# Altium schematic sheet ESP_12主板.SchDoc
size A4
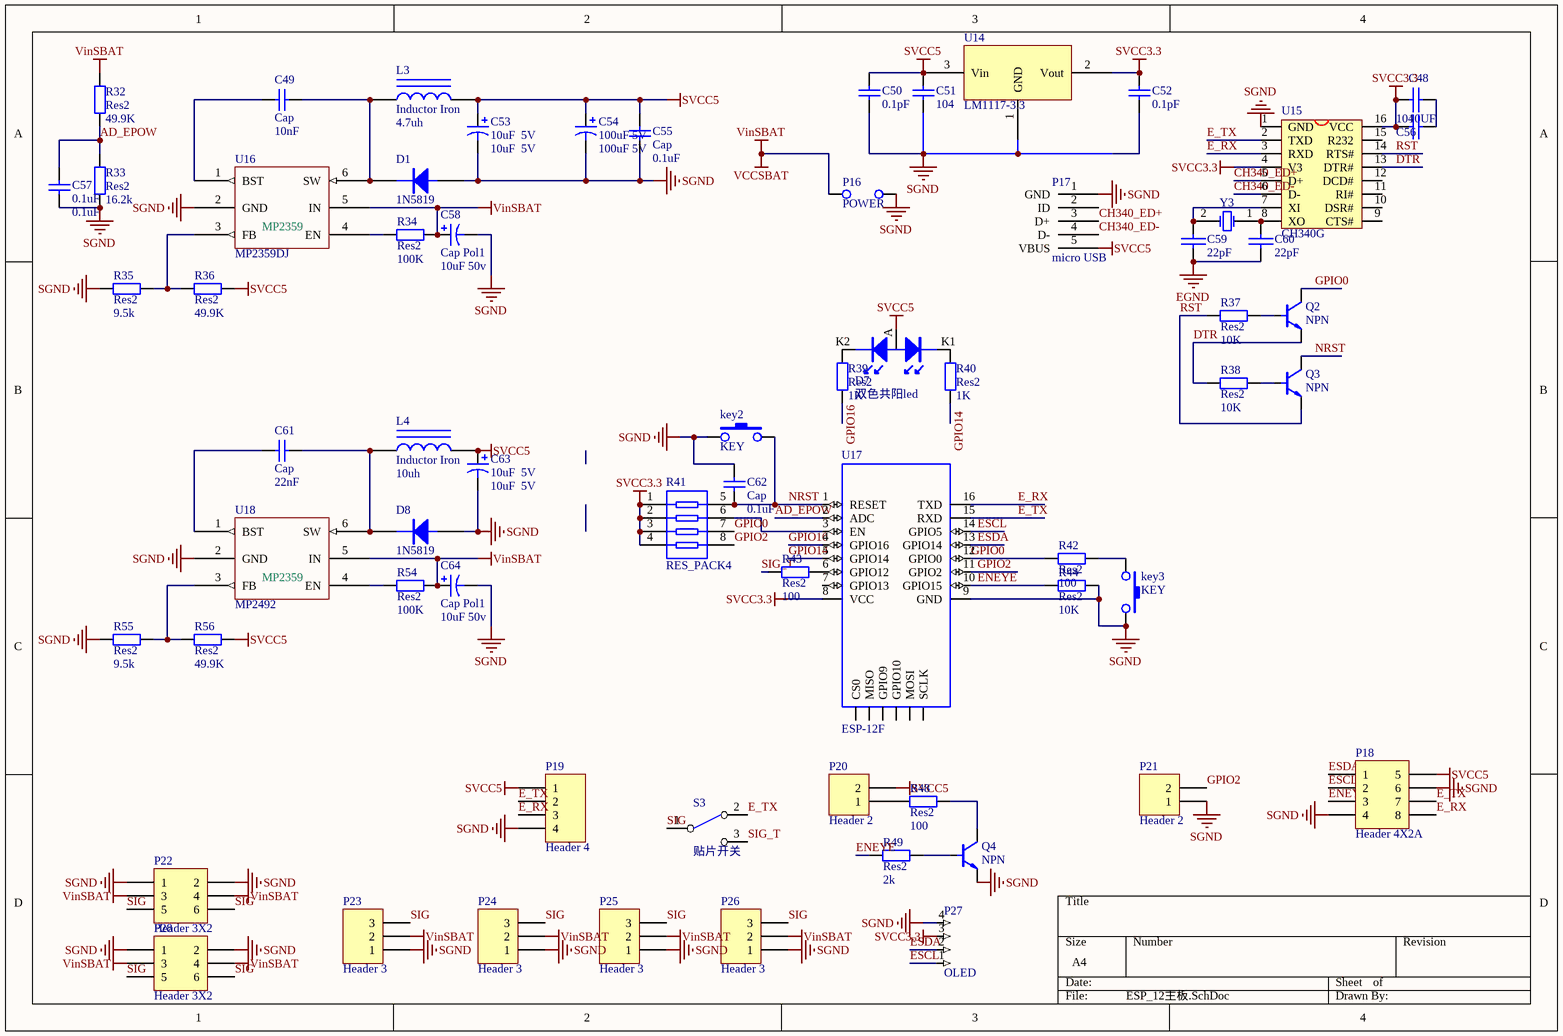
[diagram p0: ESP_12主板.SchDoc]

## Parts
C48  value 10UF  [LC-0603_C]  (hidden comment: CAP)
C49  Cap  value 10nF  [LC-0603_C]
C50  value 0.1pF  [LC-0603_C]  (hidden comment: Cap)
C51  value 104  [LC-1210_C]  (hidden comment: Cap)
C52  value 0.1pF  [LC-0603_C]  (hidden comment: Cap)
C53  10uF  5V  [LC-1210_C]
C54  100uF 5V  [电容HONOR_63X77]
C55  Cap  value 0.1uF  [LC-0603_C]
C56  value 104  [LC-1206_C]  (hidden comment: CAP)
C57  0.1uF  [LC-0603_C]
C58  Cap Pol1  value 10uF 50v  [电容HONOR_63X54]
C59  value 22pF  [LC-0603_C]  (hidden comment: CAP)
C60  value 22pF  [LC-0603_C]  (hidden comment: CAP)
C61  Cap  value 22nF  [LC-0603_C]
C62  Cap  value 0.1uF  [LC-0603_C]
C63  10uF  5V  [LC-1210_C]
C64  Cap Pol1  value 10uF 50v  [电容HONOR_63X54]
D1  1N5819  [SMA]
D7  双色共阳led  [共阳双色LED]
D8  1N5819  [SMA]
key2  KEY  [SMD轻触按键]
key3  KEY  [SMD轻触按键]
L3  Inductor Iron  value 4.7uh  [电感GDCD4532]
L4  Inductor Iron  value 10uh  [电感GDCD4532]
P16  POWER  [电源]
P17  micro USB  [micro 5P沉板式0.8四脚全插无导位有孔]
P18  Header 4X2A  [HDR2X4_CEN]
P19  Header 4  [HDR1X4]
P20  Header 2  [HDR1X2]
P21  Header 2  [HDR1X2]
P22  Header 3X2  [HDR2X3]
P23  Header 3  [AMP 3针连接件]
P24  Header 3  [AMP 3针连接件]
P25  Header 3  [AMP 3针连接件]
P26  Header 3  [AMP 3针连接件]
P27  OLED  [1.0MM 翻盖 下接 FPC连接器 4P]
P28  Header 3X2  [HDR2X3]
Q2  NPN  [LC-SOT-23]
Q3  NPN  [LC-SOT-23]
Q4  NPN  [LC-SOT-23]
R32  Res2  value 49.9K  [LC-0603_R]
R33  Res2  value 16.2k  [LC-0603_R]
R34  Res2  value 100K  [LC-0603_R]
R35  Res2  value 9.5k  [LC-0603_R]
R36  Res2  value 49.9K  [LC-0603_R]
R37  Res2  value 10K  [LC-0603_R]
R38  Res2  value 10K  [LC-0603_R]
R39  Res2  value 1K  [LC-0603_R]
R40  Res2  value 1K  [LC-0603_R]
R41  RES_PACK4  [RES4]
R42  Res2  value 100  [LC-0603_R]
R43  Res2  value 100  [LC-0603_R]
R44  Res2  value 10K  [LC-0603_R]
R48  Res2  value 100  [LC-0603_R]
R49  Res2  value 2k  [LC-0603_R]
R54  Res2  value 100K  [LC-0603_R]
R55  Res2  value 9.5k  [LC-0603_R]
R56  Res2  value 49.9K  [LC-0603_R]
S3  贴片开关  [KEY]
U14  LM1117-3.3  [SOT223]
U15  CH340G  [SOP16M]
U16  MP2359DJ  [LC-SOT-23-6]
U17  ESP-12F  [ESP_12]
U18  MP2492  [LC-SOT-23-6]
Y3  12MHz  [49SMD]  (value not drawn)

## Nets
EGND: C59.1 C60.1
SGND: C50.2 C51.1 C52.2 C53.2 C54.2 C55.1 C57.2 C58.2 C62.2 C63.2 C64.2 D1.A D8.A key2.1 key3.2 P16.2 P17.1(GND) P18.4 P18.6 P19.4 P21.1 P22.1 P22.2 P23.1 P24.1 P25.1 P26.1 P27.4 P28.1 P28.2 Q4.E(e) R33.2 R35.2 R44.2 R55.2 U14.1(GND) U15.1(GND) U16.2(GND) U17.9(GND) U18.2(GND)
SVCC3.3: C48.2 C52.1 C56.1 P27.3 R41.1 R41.2 R41.3 R41.4 U14.2(Vout) U15.4(V3) U15.16(VCC) U17.8(VCC)
SVCC5: C50.1 C51.2 C53.1 C54.1 C55.2 C63.1 D7.A L3.2 L4.2 P17.5(VBUS) P18.5 P19.1 P20.2 R36.1 R56.1 U14.3(Vin)
VCCSBAT: C58.1 C64.1 P16.1 P22.3 P22.4 P23.2 P24.2 P25.2 P26.2 P28.3 P28.4 R32.1 R34.2 R54.2 U16.5(IN) U18.5(IN)  [also labelled VinSBAT]
AD_EPOW: C57.1 R32.2 R33.1 U17.2(ADC)
CH340_ED+: P17.3(D+) U15.5(D+)
CH340_ED-: P17.4(D-) U15.6(D-)
DTR: Q2.E(e) R38.1 U15.13(DTR#)
E_RX: P18.8 P19.3 U15.3(RXD) U17.16(TXD)
E_TX: P18.7 P19.2 S3.2(NC1) U15.2(TXD) U17.15(RXD)
ENEYE: P18.3 R44.1 R49.2 U17.10(GPIO15)
ESCL: P18.2 P27.1 U17.14(GPIO5)
ESDA: P18.1 P27.2 U17.13(GPIO14)
GPIO0: Q2.C(c) R41.7 R42.1 U17.12(GPIO0)
GPIO2: P21.2 R41.8 U17.11(GPIO2)
GPIO14: R40.1 U17.5(GPIO14)
GPIO16: R39.1 U17.4(GPIO16)
NRST: C62.1 key2.2 Q3.C(c) R41.5 U17.1(RESET)
RST: Q3.E(e) R37.1 U15.14(RTS#)
SIG: P22.5 P22.6 P23.3 P24.3 P25.3 P26.3 P28.5 P28.6 S3.1(COMMON1)
SIG_T: R43.1 S3.3(NO1)
NetC48_1: C48.1 C56.2
NetC49_1: C49.1 U16.1(BST)
NetC49_2: C49.2 D1.K L3.1 U16.6(SW)
NetC59_2: C59.2 U15.7(XI) Y3.2(OSC2)
NetC60_2: C60.2 U15.8(XO) Y3.1(OSC1)
NetC61_1: C61.1 U18.1(BST)
NetC61_2: C61.2 D8.K L4.1 U18.6(SW)
NetD7_K1: D7.K1 R40.2
NetD7_K2: D7.K2 R39.2
Netkey3_1: key3.1 R42.2
NetP20_1: P20.1 R48.1
NetQ2_B: Q2.B(b) R37.2
NetQ3_B: Q3.B(b) R38.2
NetQ4_B: Q4.B(b) R49.1
NetQ4_C: Q4.C(c) R48.2
NetR34_1: R34.1 U16.4(EN)
NetR35_1: R35.1 R36.2 U16.3(FB)
NetR41_6: R41.6 U17.3(EN)
NetR43_2: R43.2 U17.6(GPIO12)
NetR54_1: R54.1 U18.4(EN)
NetR55_1: R55.1 R56.2 U18.3(FB)

Not connected (* = marked no-connect by the designer): P17 2(ID); U15 9(CTS#) 10(DSR#) 11(RI#) 12(DCD#) 15(R232); U17 7(GPIO13) 17(CS0) 18(MISO) 19(GPIO9) 20(GPIO10) 21(MOSI) 22(SCLK)

## Notes on the sheet
- (in symbol MP2359DJ) MP2359

## Library data of the parts
C49-C52 C55 C57 C61 C62 = Cap: Capacitor; Published: 8-Jun-2000; LatestRevisionDate: 17-Jul-2002; LatestRevisionNote: Re-released for DXP Platform.; PackageReference: RAD-0.3; Publisher: Altium Limited
  C57: Value: 0.1uF
C53 C54 C58 C63 C64 = Cap Pol1: Polarized Capacitor (Radial); Published: 8-Jun-2000; LatestRevisionDate: 17-Jul-2002; LatestRevisionNote: Re-released for DXP Platform.; PackageReference: RB7.6-15; Publisher: Altium Limited
  C53 C63: Value: 10uF  5V
  C54: Value: 100uF 5V
D1 D8 = 1N4001: pin to pad: A>1 K>2
D7 = 双色共阳led: pin to pad: A>2 K1>1 K2>3
L3 L4 = Inductor Iron: Magnetic-Core Inductor; Published: 24-Mar-1999; LatestRevisionDate: 17-Jul-2002; LatestRevisionNote: Re-released for DXP Platform.; PackageReference: AXIAL-0.9; Publisher: Altium Limited
P17 = micro 5P
P18 = Header 4X2A: Header, 4-Pin, Dual row; LatestRevisionDate: 17-Jul-2002; LatestRevisionNote: Re-released for DXP Platform.; Publisher: Altium Limited
P19 = Header 4: Header, 4-Pin; LatestRevisionDate: 17-Jul-2002; LatestRevisionNote: Re-released for DXP Platform.; Publisher: Altium Limited
P20 P21 = Header 2: Header, 2-Pin; LatestRevisionDate: 17-Jul-2002; LatestRevisionNote: Re-released for DXP Platform.; Publisher: Altium Limited
P22 P28 = Header 3X2: Header, 3-Pin, Dual row; LatestRevisionDate: 17-Jul-2002; LatestRevisionNote: Re-released for DXP Platform.; Publisher: Altium Limited
P23-P26 = Header 3: Header, 3-Pin; LatestRevisionDate: 17-Jul-2002; LatestRevisionNote: Re-released for DXP Platform.; Publisher: Altium Limited
P27 = FPC 4P 1MM
Q2-Q4 = NPN: pin to pad: B>1 C>3 E>2
R32-R40 R42-R44 R48 R49 R54-R56 = Res2: Resistor; Published: 8-Jun-2000; LatestRevisionDate: 17-Jul-2002; LatestRevisionNote: Re-released for DXP Platform.; PackageReference: AXIAL-0.4; Publisher: Altium Limited
S3 = 贴片开关: pin to pad: 1>2 2>1
U15 = CH340G: USB2UART
U18 = MP2359DJ
Y3 = XTAL: Crystal Oscillator; Value: 8MHZ; Published: 8-Jun-2000; LatestRevisionDate: 17-Jul-2002; LatestRevisionNote: Re-released for DXP Platform.; Publisher: Altium Limited